# Altium schematic sheet periferels.SchDoc
size A4; SheetNumber: 3; SheetTotal: 4
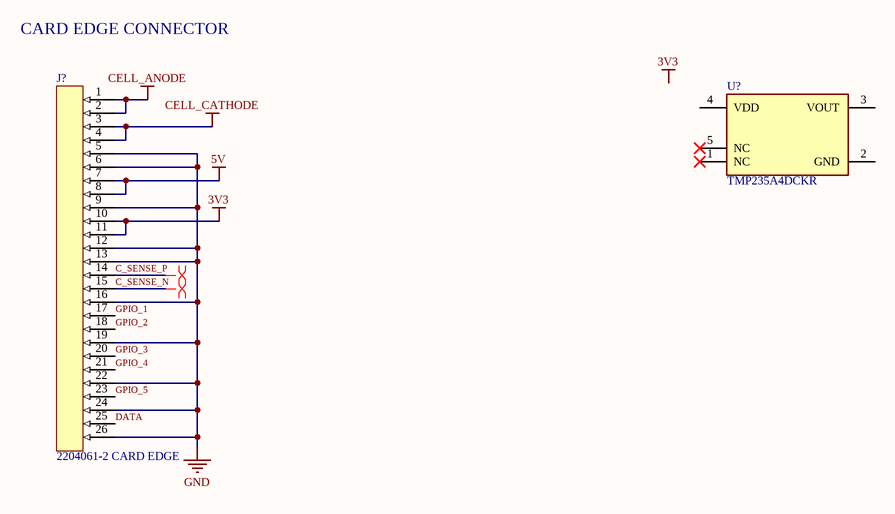
[diagram p0: periferels.SchDoc]

## Parts
J?  2204061-2 CARD EDGE  [2204061-2 CARD EDGE-Footprint-1]
U?  TMP235A4DCKR  [FP-DCK0005A-MFG]

## Nets
3V3: J?.10 J?.11
5V: J?.7 J?.8
CELL_ANODE: J?.1 J?.2
CELL_CATHODE: J?.3 J?.4
GND: J?.5 J?.6 J?.9 J?.12 J?.13 J?.16 J?.19 J?.22 J?.24 J?.26
C_SENSE_N: J?.15
C_SENSE_P: J?.14
DATA: J?.25
GPIO_1: J?.17
GPIO_2: J?.18
GPIO_3: J?.20
GPIO_4: J?.21
GPIO_5: J?.23

Not connected (* = marked no-connect by the designer): U? 1(NC)* 2(GND) 3(VOUT) 4(VDD) 5(NC)*

## Layout directives
differential pair: C_SENSE_N, C_SENSE_P

## Notes on the sheet
- CARD EDGE CONNECTOR
- Labels drawn without touching a wire or pin: 3V3

## Library data of the parts
J? = CMP-002-00073-1
U? = CMP-04948-000022-1: SENSOR ANALOG -40C-150C SC70-5; Manufacturer: Texas Instruments; Max Junction Temp: +150°C; Output Current: 500uA; Standoff Height: 0mm; Output Voltage: 100-2000mV; Operating Supply Current: 9-10uA; Min Supply Voltage: 2.3V; Sensor Output: Analog Voltage; Max Supply Voltage: 5.5V; Description: ±1.2°C 2.3V to 5.5V analog output temperature sensor with -13.6 mV/°C gain 5-SC70 -40 to 150; Ambient Temperature Range High: +150°C; Manufacturer Part Number: TMP235A4DCKR; Temperature Range Low: -40°C; Temperature Range High: +150°C; Lead Free: Yes; Mouser Description: ±2.5°C Analog output temperature sensor, with 10mV /°C gain 5-SC70 -40 to 150; Height: 1.1mm; ComponentLink2Description: Datasheet; ComponentLink2URL: https://www.ti.com/lit/ds/symlink/tmp235.pdf; Device Class L1: Sensors; Ambient Temperature Range Low: -40°C; Temperature: -40°C to +150°C; Device Class L2: Temperature and Humidity Sensors; Category: IC; Digikey Description: SENSOR ANALOG -40C-150C SC70-5; Automotive: No; RoHS: TRUE; Device Class L3: unset; Package: DCK0005A; Octopart: https://octopart.com/tmp235a4dckr-texas+instruments-88184449